# EAGLE board bm812i (EAGLE 6.6.0), part 1 of 4
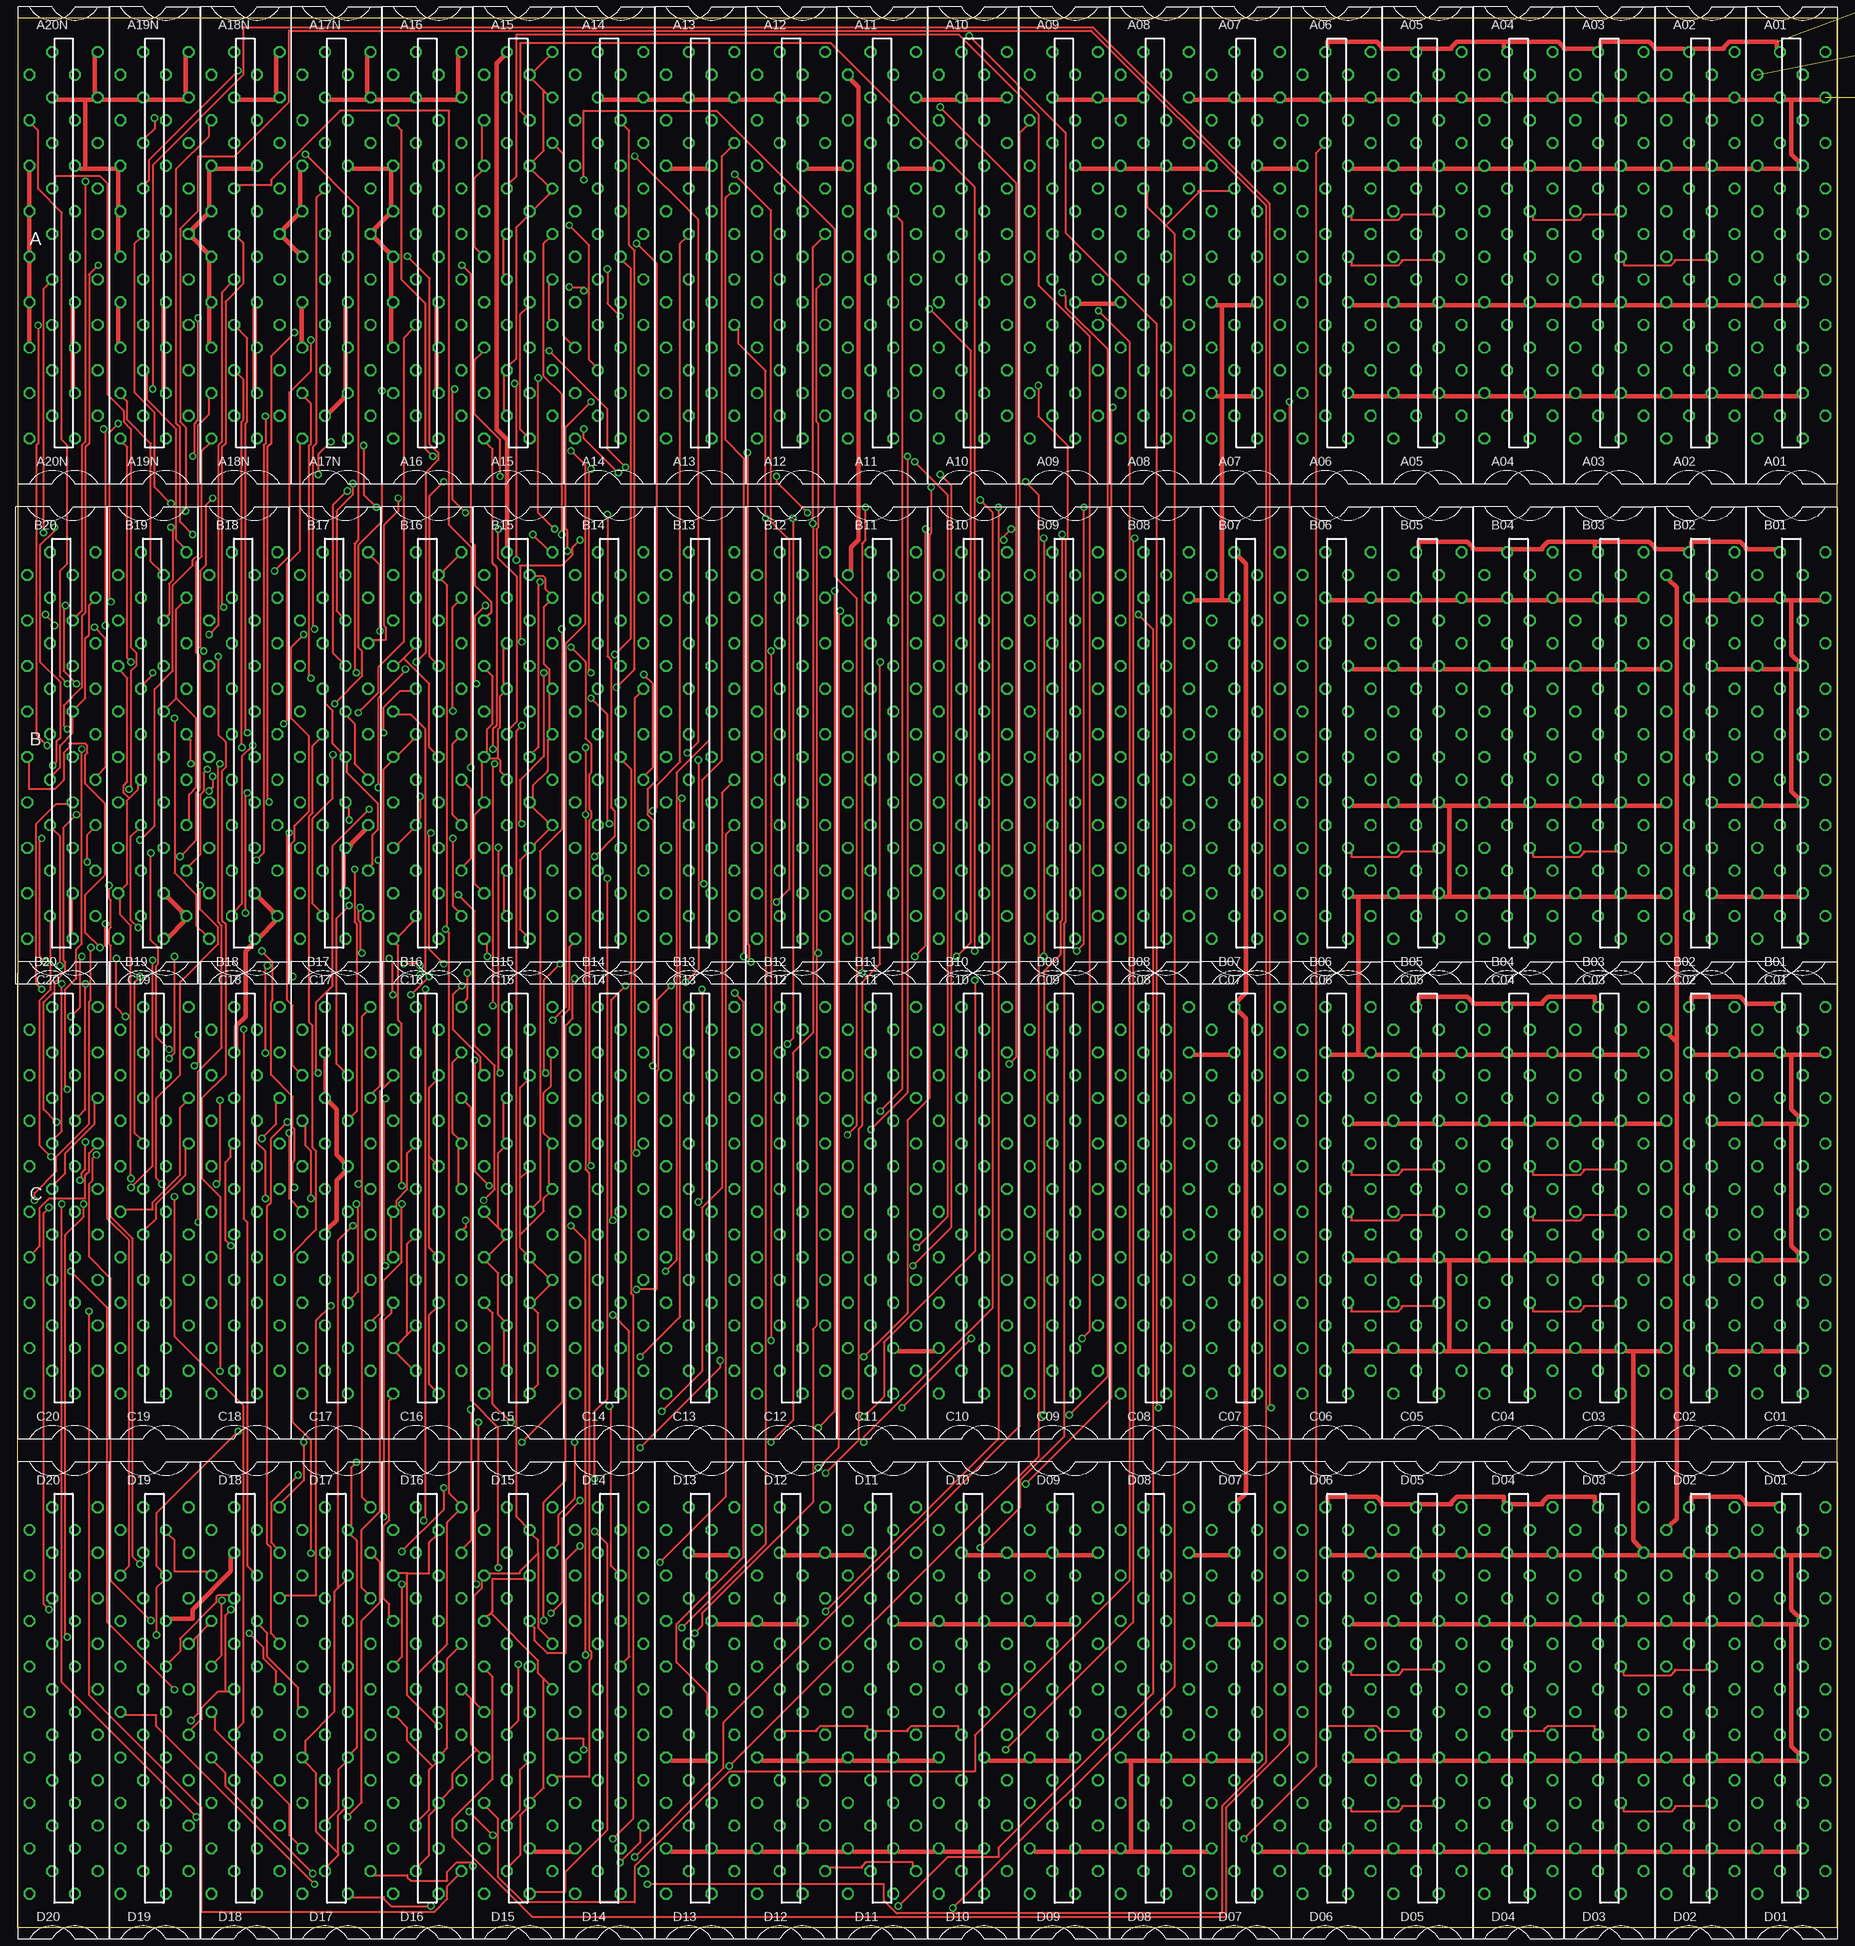
[diagram p5: board, top side]
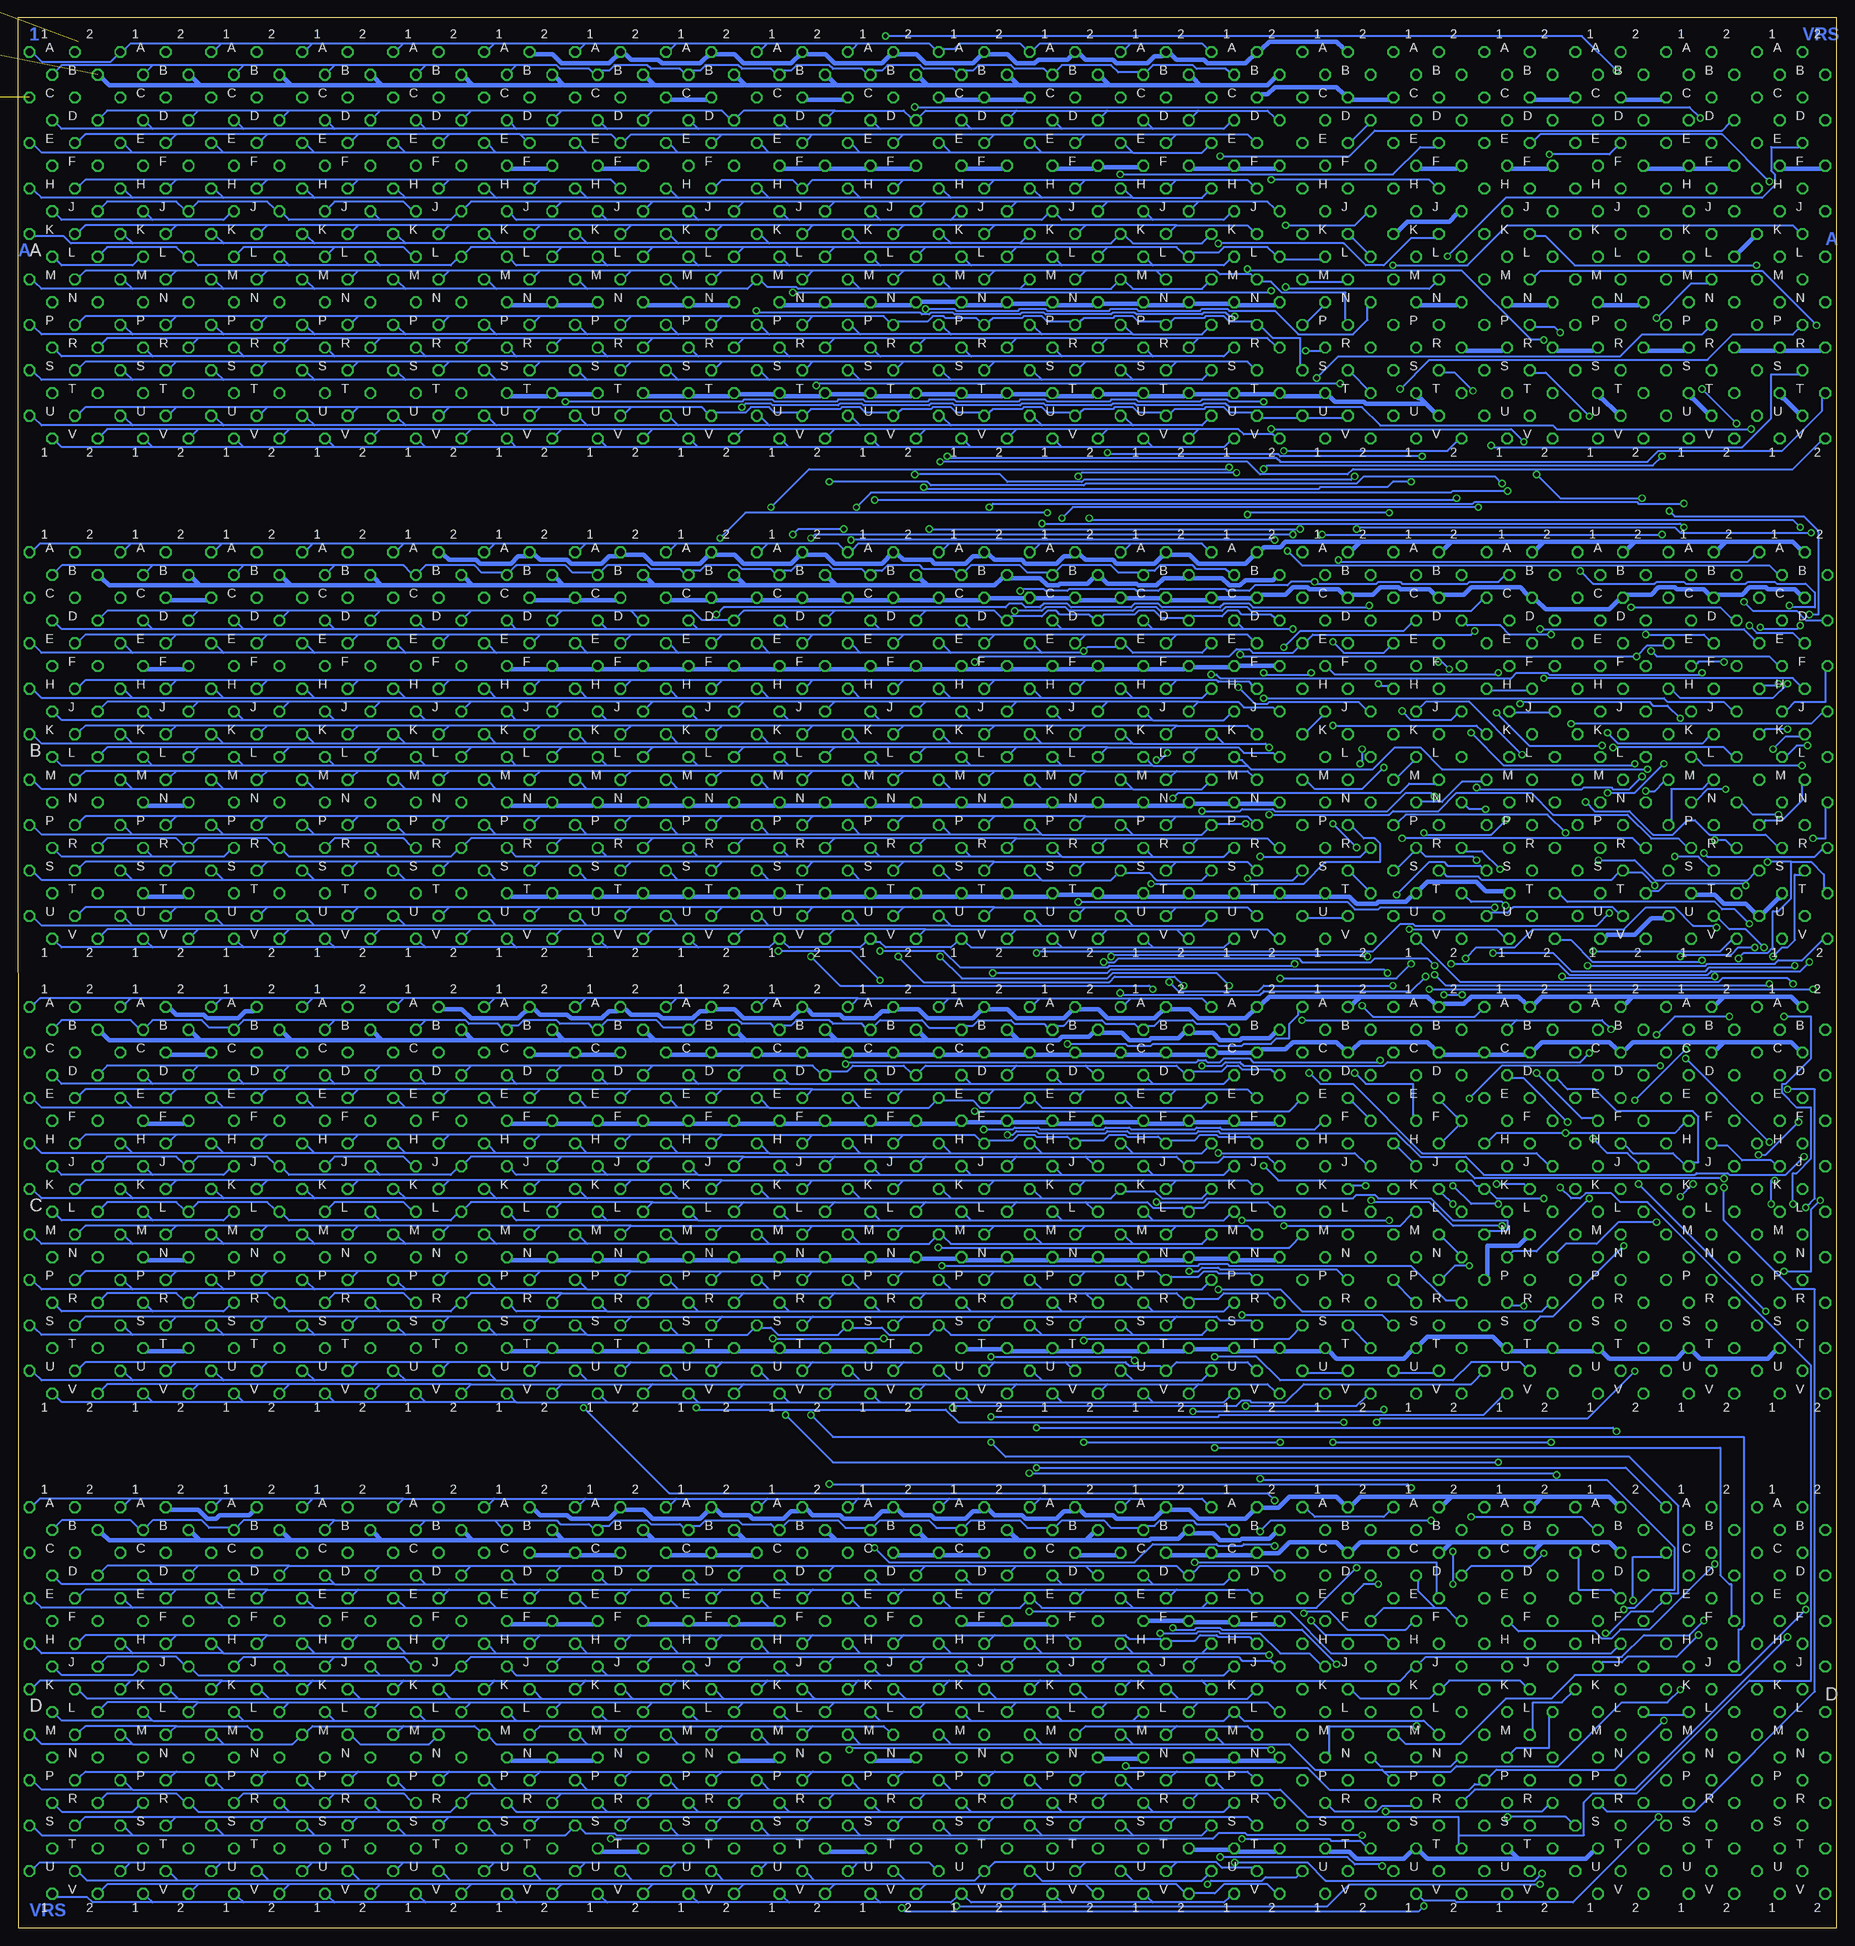
[diagram p6: board, bottom side, seen from below]

Size 254.06 x 266.69 mm. Coordinates in mm from the lower left corner, seen from the top.
Outline: 254.03,0 0,0 0.03,266.67 254.06,266.69 254.03,0
Copper layers (1*2*15*16): Top 0.035mm / dielectric 1.5mm / Route2 0.035mm / dielectric 0.15mm / Route15 0.035mm / dielectric 0.2mm / Bottom 0.035mm
Design rules "10mils *": minimum track width 10mil, minimum drill 24mil, track to track 5mil, track to pad 10mil, pad to pad 10mil, via to via 5mil, smd to smd 10mil, copper to edge 10mil, drill to drill 10mil, minimum pad ring 10mil, minimum via ring 8mil, stop-mask expansion 0mil, vias tented up to drill 0mil, thermal gap 10mil
Net classes: 1 Power: width 0.635 mm

## Footprints (pad centres in the part's own frame; a part is rotated, then mirrored left to right if it is on the bottom)
2,54/0,8 = drill 0.813 pad 2.54 octagon: 1 0,0
H807 = drill 1.092 octagon: A1 4.763,28.575; A2 -1.587,28.575; B1 1.587,25.4; B2 -4.763,25.4; C1 4.763,22.225; C2 -1.587,22.225; D1 1.587,19.05; D2 -4.763,19.05; E1 4.763,15.875; E2 -1.587,15.875; F1 1.587,12.7; F2 -4.763,12.7; H1 4.763,9.525; H2 -1.587,9.525; J1 1.587,6.35; J2 -4.763,6.35; K1 4.763,3.175; K2 -1.587,3.175; L1 1.587,0; L2 -4.763,0; M1 4.763,-3.175; M2 -1.587,-3.175; N1 1.587,-6.35; N2 -4.763,-6.35; P1 4.763,-9.525; P2 -1.587,-9.525; R1 1.587,-12.7; R2 -4.763,-12.7; S1 4.763,-15.875; S2 -1.587,-15.875; T1 1.587,-19.05; T2 -4.763,-19.05; U1 4.763,-22.225; U2 -1.587,-22.225; V1 1.587,-25.4; V2 -4.763,-25.4

## Placement (x,y rotation side)
+5V  [2,54/0,8]  258.8,268.27 0 top  (outside the outline)
-15V  [2,54/0,8]  258.8,261.92 0 top  (outside the outline)
A01  M916  [H807]  247.69,233.35 0 top
A02  M916  [H807]  234.99,233.35 0 top
A03  M916  [H807]  222.29,233.35 0 top
A04  M916  [H807]  209.59,233.35 0 top
A05  M916  [H807]  196.89,233.35 0 top
A06  M916  [H807]  184.19,233.35 0 top
A07  M916  [H807]  171.49,233.35 0 top
A08  M916  [H807]  158.79,233.35 0 top
A09  M916  [H807]  146.09,233.35 0 top
A10  M916  [H807]  133.39,233.35 0 top
A11  M916  [H807]  120.69,233.35 0 top
A12  M916  [H807]  107.99,233.35 0 top
A13  M916  [H807]  95.29,233.35 0 top
A14  M916  [H807]  82.59,233.35 0 top
A15  M627  [H807]  69.89,233.35 0 top
A16  M903  [H807]  57.19,233.35 0 top
A17N  M903  [H807]  44.49,233.35 0 top
A18N  M903  [H807]  31.79,233.35 0 top
A19N  M903  [H807]  19.09,233.35 0 top
A20N  M903  [H807]  6.39,233.35 0 top
B01  M916  [H807]  247.69,163.5 0 top
B02  M916  [H807]  234.99,163.5 0 top
B03  M916  [H807]  222.29,163.5 0 top
B04  M916  [H807]  209.59,163.5 0 top
B05  M916  [H807]  196.89,163.5 0 top
B06  M916  [H807]  184.19,163.5 0 top
B07  M916  [H807]  171.49,163.5 0 top
B08  M916  [H807]  158.79,163.5 0 top
B09  M916  [H807]  146.09,163.5 0 top
B10  M916  [H807]  133.39,163.5 0 top
B11  M916  [H807]  120.69,163.5 0 top
B12  M916  [H807]  107.99,163.5 0 top
B13  M916  [H807]  95.29,163.5 0 top
B14  M916  [H807]  82.59,163.5 0 top
B15  M627  [H807]  69.89,163.5 0 top
B16  M115  [H807]  57.19,163.5 0 top
B17  M113  [H807]  44.17,163.5 0 top
B18  M623  [H807]  31.47,163.5 0 top
B19  M623  [H807]  18.77,163.5 0 top
B20  M623  [H807]  6.07,163.5 0 top
C01  M916  [H807]  247.69,100 0 top
C02  M916  [H807]  234.99,100 0 top
C03  M916  [H807]  222.29,100 0 top
C04  M916  [H807]  209.59,100 0 top
C05  M916  [H807]  196.89,100 0 top
C06  M916  [H807]  184.19,100 0 top
C07  M916  [H807]  171.49,100 0 top
C08  M916  [H807]  158.79,100 0 top
C09  M916  [H807]  146.09,100 0 top
C10  M916  [H807]  133.39,100 0 top
C11  M916  [H807]  120.69,100 0 top
C12  M916  [H807]  107.99,100 0 top
C13  M916  [H807]  95.29,100 0 top
C14  M916  [H807]  82.59,100 0 top
C15  M627  [H807]  69.89,100 0 top
C16  M627  [H807]  57.19,100 0 top
C17  M206X  [H807]  44.49,100 0 top
C18  M310  [H807]  31.79,100 0 top
C19  M310  [H807]  19.09,100 0 top
C20  M310  [H807]  6.39,100 0 top
D01  M916  [H807]  247.69,30.15 0 top
D02  M916  [H807]  234.99,30.15 0 top
D03  M916  [H807]  222.29,30.15 0 top
D04  M916  [H807]  209.59,30.15 0 top
D05  M916  [H807]  196.89,30.15 0 top
D06  M916  [H807]  184.19,30.15 0 top
D07  M916  [H807]  171.49,30.15 0 top
D08  M916  [H807]  158.79,30.15 0 top
D09  M916  [H807]  146.09,30.15 0 top
D10  M916  [H807]  133.39,30.15 0 top
D11  M916  [H807]  120.69,30.15 0 top
D12  M916  [H807]  107.99,30.15 0 top
D13  M916  [H807]  95.29,30.15 0 top
D14  M916  [H807]  82.59,30.15 0 top
D15  M206X  [H807]  69.89,30.15 0 top
D16  M206X  [H807]  57.19,30.15 0 top
D17  M206X  [H807]  44.49,30.15 0 top
D18  M111  [H807]  31.79,30.15 0 top
D19  M921  [H807]  19.09,30.15 0 top
D20  H807  [H807]  6.39,30.15 0 top
GND  [2,54/0,8]  258.48,255.57 0 top  (outside the outline)

## Tracks (layer width: path | path; a pad name or v marks a point on that pad's centre or on a via)
-15V  (1 unrouted)
  Top 0.635: 231.68,123.69 231.68,57.14 230.67,56.12 D02.B2 | 231.68,123.69 230.67,124.7 C02.B2 | 231.68,123.69 231.68,187.19 230.67,188.2 B02.B2 | A11.B2 116.37,258.05 117.38,257.04 117.38,193.79 116.37,192.77 116.37,189.47 B11.B2
  Bottom 0.635: 88.94,257.29 79.54,257.29 78.52,258.31 A14.B2 | 88.94,257.29 89.95,258.31 A13.B2 | 101.76,257.42 101.64,257.29 88.94,257.29 | 101.76,257.42 102.65,258.31 A12.B2 | 114.46,257.42 114.34,257.29 101.89,257.29 101.76,257.42 | 114.46,257.42 115.35,258.31 A11.B2 | 127.16,257.42 127.04,257.29 114.59,257.29 114.46,257.42 | 127.16,257.42 128.05,258.31 A10.B2 | 139.86,257.42 139.74,257.29 127.29,257.29 127.16,257.42 | 139.86,257.42 140.75,258.31 A09.B2 | 152.56,257.42 152.44,257.29 139.99,257.29 139.86,257.42 | 152.56,257.42 153.45,258.31 A08.B2 | 165.26,257.42 165.14,257.29 152.69,257.29 152.56,257.42 | 165.26,257.42 166.15,258.31 A07.B2 | 177.96,257.42 177.84,257.29 165.39,257.29 165.26,257.42 | 177.96,257.42 178.85,258.31 A06.B2 | 190.66,257.42 190.54,257.29 178.09,257.29 177.96,257.42 | 190.66,257.42 191.55,258.31 A05.B2 | 203.36,257.42 203.24,257.29 190.79,257.29 190.66,257.42 | 203.36,257.42 204.25,258.31 A04.B2 | 216.06,257.42 215.94,257.29 203.49,257.29 203.36,257.42 | 216.06,257.42 216.95,258.31 A03.B2 | 228.76,257.42 228.64,257.29 216.19,257.29 216.06,257.42 | 228.76,257.42 229.65,258.31 A02.B2 | A01.B2 242.35,258.31 241.34,257.29 228.89,257.29 228.76,257.42 | B14.B2 78.52,188.46 78.78,188.2 82.59,188.2 83.35,187.44 84.87,187.44 85.89,188.46 89.95,188.46 B13.B2 91.22,188.46 94.02,188.46 95.03,187.44 97.57,187.44 97.83,187.69 101.89,187.69 102.65,188.46 B12.B2 103.92,188.46 104.68,187.69 108.49,187.69 108.75,187.44 110.27,187.44 111.29,188.46 115.35,188.46 B11.B2 116.62,188.46 117.64,187.44 127.04,187.44 | 127.04,187.44 128.05,188.46 B10.B2 | 139.86,187.57 139.74,187.44 127.04,187.44
  Bottom 0.635: 139.86,187.57 140.75,188.46 B09.B2 | 152.56,187.57 152.44,187.44 139.99,187.44 139.86,187.57 | 152.56,187.57 153.45,188.46 B08.B2 | 165.26,187.57 165.14,187.44 152.69,187.44 152.56,187.57 | 165.26,187.57 166.15,188.46 B07.B2 | 177.96,187.57 177.84,187.44 165.39,187.44 165.26,187.57 | 177.96,187.57 178.85,188.46 B06.B2 | 190.66,187.57 190.54,187.44 178.09,187.44 177.96,187.57 | 190.66,187.57 191.55,188.46 B05.B2 | 203.36,187.57 203.24,187.44 190.79,187.44 190.66,187.57 | 203.36,187.57 204.25,188.46 B04.B2 | 216.06,187.57 215.94,187.44 203.49,187.44 203.36,187.57 | 216.06,187.57 216.95,188.46 B03.B2 | 228.76,187.57 228.64,187.44 216.19,187.44 216.06,187.57 | 228.76,187.57 229.65,188.46 B02.B2 | B01.B2 242.35,188.46 241.34,187.44 228.89,187.44 228.76,187.57 | D14.B2 78.52,55.11 79.28,54.34 83.09,54.34 83.35,54.09 86.14,54.09 87.16,55.11 89.95,55.11 D13.B2 91.22,55.11 91.98,54.34 95.79,54.34 96.05,54.09 104.68,54.09 104.81,54.22 | 104.81,54.22 104.94,54.09 114.34,54.09 | 104.81,54.22 103.92,55.11 D12.B2 | 114.34,54.09 115.35,55.11 D11.B2 | 127.16,54.22 127.04,54.09 114.34,54.09 | 127.16,54.22 128.05,55.11 D10.B2 | 139.86,54.22 139.74,54.09 127.29,54.09 127.16,54.22 | 139.86,54.22 140.75,55.11 D09.B2 | 152.56,54.22 152.44,54.09 139.99,54.09 139.86,54.22 | 152.56,54.22 153.45,55.11 D08.B2 | 165.26,54.22 165.14,54.09 152.69,54.09 152.56,54.22 | 165.26,54.22 166.15,55.11 D07.B2 | 177.96,54.22 177.84,54.09 165.39,54.09 165.26,54.22 | 177.96,54.22 178.85,55.11 D06.B2 | 190.66,54.22 190.54,54.09 178.09,54.09 177.96,54.22 | 190.66,54.22 191.55,55.11 D05.B2 | 203.36,54.22 203.24,54.09 190.79,54.09 190.66,54.22
  Bottom 0.635: 203.36,54.22 204.25,55.11 D04.B2 | 216.06,54.22 215.94,54.09 203.49,54.09 203.36,54.22 | 216.06,54.22 216.95,55.11 D03.B2 | 228.76,54.22 228.64,54.09 216.19,54.09 216.06,54.22 | 228.76,54.22 229.65,55.11 D02.B2 | D01.B2 242.35,55.11 241.34,54.09 228.89,54.09 228.76,54.22 | C14.B2 78.52,124.96 79.28,124.19 83.09,124.19 83.35,123.94 86.14,123.94 87.16,124.96 89.95,124.96 C13.B2 91.22,124.96 91.98,124.19 95.79,124.19 96.05,123.94 98.84,123.94 99.86,124.96 102.65,124.96 C12.B2 103.92,124.96 104.43,124.45 108.24,124.45 108.75,123.94 114.34,123.94 | 114.34,123.94 115.35,124.96 C11.B2 | 127.16,124.07 127.04,123.94 114.34,123.94 | 127.16,124.07 128.05,124.96 C10.B2 | 139.86,124.07 139.74,123.94 127.29,123.94 127.16,124.07 | 139.86,124.07 140.75,124.96 C09.B2 | 152.56,124.07 152.44,123.94 139.99,123.94 139.86,124.07 | 152.56,124.07 153.45,124.96 C08.B2 | 165.26,124.07 165.14,123.94 152.69,123.94 152.56,124.07 | 165.26,124.07 166.15,124.96 C07.B2 | 177.96,124.07 177.84,123.94 165.39,123.94 165.26,124.07 | 177.96,124.07 178.85,124.96 C06.B2 | 190.66,124.07 190.54,123.94 178.09,123.94 177.96,124.07 | 190.66,124.07 191.55,124.96 C05.B2 | 203.36,124.07 203.24,123.94 190.79,123.94 190.66,124.07 | 203.36,124.07 204.25,124.96 C04.B2 | 216.06,124.07 215.94,123.94 203.49,123.94 203.36,124.07 | 216.06,124.07 216.95,124.96 C03.B2 | 228.76,124.07 228.64,123.94 216.19,123.94 216.06,124.07 | 228.76,124.07 229.65,124.96 C02.B2 | C01.B2 242.35,124.96 241.34,123.94 228.89,123.94 228.76,124.07
A15U1
  Top 0.254: 73.44,256.53 71.92,258.05 A15.B1 72.17,259.07 72.17,259.32 74.2,261.35 A15.A1 | 73.44,256.53 73.95,256.02 A15.C1 | 73.44,256.53 73.44,248.15 71.92,246.62 A15.F1 71.92,245.35 73.95,243.32 A15.H1 74.2,242.3 74.2,242.05 72.17,240.02 A15.J1 71.16,239 69.63,237.48 69.63,219.19 68.62,218.17 A15.S2 67.85,216.9 67.85,211.82 A15.U2
  Bottom 0.254: 168.44,212.33 158.53,212.33 157.77,211.57 A08.U2 156.5,211.57 152.44,211.57 151.67,212.33 149.13,212.33 148.37,211.57 145.07,211.57 A09.U2 143.8,211.57 143.29,212.08 139.23,212.08 138.97,212.33 136.43,212.33 135.67,211.57 132.37,211.57 A10.U2 131.1,211.57 130.59,212.08 126.53,212.08 126.27,212.33 123.73,212.33 122.97,211.57 119.67,211.57 A11.U2 118.4,211.57 117.89,212.08 113.83,212.08 113.57,212.33 111.03,212.33 110.27,211.57 106.97,211.57 A12.U2 105.7,211.57 105.19,212.08 101.13,212.08 100.87,212.33 98.33,212.33 97.57,211.57 94.27,211.57 A13.U2 93,211.57 92.49,212.08 88.43,212.08 88.17,212.33 85.63,212.33 84.87,211.57 81.57,211.57 A14.U2 80.3,210.81 75.22,210.81 A15.U1 73.95,210.81 68.87,210.81 A15.U2 | 168.44,212.33 169.2,211.57 A07.U2 | 181.14,212.33 181.9,211.57 A06.U2 | 168.44,212.33 181.14,212.33 | 193.84,212.33 194.6,211.57 A05.U2 | 181.14,212.33 193.84,212.33 | 206.54,212.33 207.3,211.57 A04.U2 | 193.84,212.33 206.54,212.33 | 219.24,212.33 220,211.57 A03.U2 | 206.54,212.33 219.24,212.33 | 231.94,212.33 232.7,211.57 A02.U2 | 219.24,212.33 231.94,212.33 | 231.94,212.33 244.64,212.33 245.4,211.57 A01.U2 | A15.T2 65.57,214.87 67.6,216.9 67.85,216.9 A15.S2
A15V1
  Top 0.254: A15.V1 70.14,209.28 70.14,225.29 71.16,226.3 A15.N1 | A15.D2 64.81,251.7 64.81,246.62 A15.F2 64.81,245.35 63.79,244.34 63.79,234.68 A15.L2 | A15.K2 67.85,235.95 67.85,230.87 A15.M2 | A15.P1 74.2,224.52 74.2,229.6 A15.M1
  Bottom 0.254: A15.P1 73.95,224.27 71.92,226.3 A15.N1 | A15.E2 67.6,249.67 65.57,251.7 A15.D2 | A15.L2 65.57,233.92 67.6,235.95 67.85,235.95 A15.K2 | A15.M2 68.87,229.86 73.95,229.86 A15.M1
B17S1  (via drill 0.61)
  Top 0.254: B17.H2 42.96,172.45 42.96,170.93 43.98,169.91 43.98,165.34 45.25,164.07 B17.L1 46.01,162.8 46.01,161.28 50.33,156.96 50.33,153.4 49.57,152.64 49.57,148.58 49.31,148.32 B17.S1 | 44.74,10.4 44.74,15.74 45.76,16.75 D17.R1 | 44.74,10.4 44.74,10.15 43.22,8.62 D17.U2 | 44.74,10.4 41.69,13.45 41.69,21.58 40.17,23.1 D17.N2 40.17,24.37 40.17,26.15 44.23,30.21 44.23,46.98 44.74,47.49 | 44.74,47.49 45.76,48.5 D17.D1 | v61.5,144.26 63.79,141.97 63.79,123.18 66.58,120.38 66.58,103.11 v65.06,101.59 | v46.77,98.03 44.74,96 44.74,47.49
  Bottom 0.254: B17.H2 43.22,172.71 48.3,172.71 B17.H1 | v61.5,144.26 56.93,148.83 54.9,148.83 54.39,148.32 49.82,148.32 49.57,148.07 B17.S1 | v65.06,101.59 64.81,101.33 56.93,101.33 53.63,98.03 v46.77,98.03
B17V1  (via drill 0.61)
  Top 0.254: D16.K2 55.92,34.02 55.92,35.55 59.98,39.61 59.98,56.63 61.5,58.15 D16.A1 61.5,59.42 60.23,60.69 60.23,138.93 v59.73,139.43 59.98,139.69 59.98,187.44 59.22,188.2 B16.B1 59.47,189.22 59.47,189.47 61.5,191.5 B16.A1
  Bottom 0.254: D16.A1 63.28,57.39 72.93,57.39 73.95,58.41 D15.A1 | D17.K2 43.47,33.77 44.23,34.53 54.14,34.53 54.9,33.77 D16.K2 56.93,31.99 66.58,31.99 67.6,33.01 D15.K2 | v59.73,139.43 47.53,139.43 46.52,138.42 B17.V1
C16U1
  Top 0.254: C16.N2 52.11,94.22 52.11,99.3 C16.L2 52.87,100.57 52.87,101.59 54.39,103.11 54.39,108.19 55.15,108.95 C16.H2 | C16.U2 54.9,78.22 52.87,80.25 C16.T2 53.12,81.27 53.12,81.52 54.39,82.79 | 54.39,82.79 55.15,83.55 C16.S2 | 54.39,82.79 54.39,95.49 55.15,96.25 C16.M2
  Bottom 0.254: C16.H2 54.9,109.97 52.87,112 C16.F2 52.87,113.27 53.12,113.27 55.15,115.3 C16.E2 | C16.N2 52.87,94.22 54.9,96.25 55.15,96.25 C16.M2 | C16.U1 61.25,77.46 56.17,77.46 C16.U2
D01BINIT  (via drill 0.61)
  Top 0.254: v51.09,57.39 51.09,84.82 52.11,85.84 52.11,86.6 C16.R2 | v67.35,202.68 67.35,207.76 63.79,211.32 63.79,218.94 64.81,219.95 A15.R2 | v128.81,202.93 130.34,201.41 130.34,97.78 v125,92.44
  Bottom 0.254: v51.09,57.39 35.6,57.39 34.07,55.87 D18.B1 | v67.35,202.68 67.85,202.17 105.19,202.17 105.45,201.92 115.86,201.92 116.88,202.93 v128.81,202.93 | v125,92.44 89.19,92.44 88.94,92.7 85.13,92.7 84.87,92.44 59.47,92.44 54.65,87.62 53.12,87.62 C16.R2
D01BTP2L  (via drill 0.61)
  Top 0.254: B16.U2 55.15,140.7 55.15,140.45 53.12,138.42 B16.V2 52.87,137.4 53.12,137.15 53.12,126.73 53.63,126.23 v53.63,103.62 | v43.72,86.86 41.69,84.82 41.69,46.47 37.12,46.47 D18.E1 | v47.28,101.08 47.53,100.83 47.53,88.89 46.52,87.87 C17.R1
  Bottom 0.254: v43.72,86.86 45.5,86.86 C17.R1 | v53.63,103.62 51.09,101.08 v47.28,101.08
D01DEL1H  (via drill 0.61)
  Top 0.254: v9.43,131.81 9.43,114.29 8.42,113.27 C20.F1 | v56.17,133.08 56.93,133.85 56.93,167.37 54.9,169.41 53.12,169.41 B16.J2 | v60.74,169.91 60.74,184.39 61.5,185.15 B16.C1
  Bottom 0.254: v9.43,131.81 9.69,131.56 54.65,131.56 v56.17,133.08 | v60.74,169.91 59.47,168.64 53.88,168.64 53.12,169.41 B16.J2
D01DEL1L  (via drill 0.61)
  Top 0.254: v40.93,101.84 40.93,108.45 40.17,109.21 40.17,112 C17.F2 | v77.25,178.8 79.28,176.77 79.28,166.1 80.05,165.34 80.05,161.28 79.79,161.02 79.79,156.2 80.05,155.94 80.05,154.93 79.79,154.67 79.79,106.67 v80.05,106.41
  Bottom 0.254: v40.93,101.84 47.53,101.84 48.55,102.86 C17.K1 49.82,103.62 50.33,103.62 51.09,104.38 78.01,104.38 v80.05,106.41 | v77.25,178.8 74.97,181.09 60.49,181.09 59.47,182.11 B16.D1
D01DEL2  (via drill 0.61)
  Top 0.254: v39.91,180.58 38.14,178.8 38.14,168.9 40.68,166.36 40.68,155.94 38.64,153.91 38.64,151.88 38.14,151.37 38.14,133.08 v38.39,132.83 | v17.05,132.83 16.29,132.07 16.29,110.99 17.05,110.22 C19.H2
  Bottom 0.254: C20.J1 8.67,106.67 9.18,107.18 13.24,107.18 15.28,109.21 16.8,109.21 C19.H2 | v39.91,180.58 45.76,180.58 47.03,181.85 51.6,181.85 51.85,182.11 B16.D2 | v38.39,132.83 38.14,132.58 17.31,132.58 v17.05,132.83
D01DEL3  (via drill 0.61)
  Top 0.254: C17.L2 37.88,101.84 v37.88,110.99
  Bottom 0.254: C19.F1 21.37,112.26 22.64,110.99 v37.88,110.99 47.53,110.99 48.55,109.97 C17.H1
D01DEL4  (via drill 0.61)
  Top 0.254: B16.P1 61.5,154.67 60.74,155.44 60.74,165.34 61.5,166.1 B16.K1 | v29.75,95.24 28.99,96 28.99,106.92 29.75,107.68 29.75,108.95 C18.H2 | v37.88,152.9 37.63,152.64 37.63,129.53 38.39,128.77 38.39,120.38 C17.D2
  Bottom 0.254: C18.H2 29.5,109.21 28.48,108.19 22.9,108.19 21.37,106.67 C19.J1 20.1,106.92 19.34,106.92 19.34,113.27 20.1,114.03 30.77,114.03 33.82,117.08 37.63,117.08 39.15,118.61 C17.D2 | v29.75,95.24 39.66,85.33 41.44,85.33 42.2,84.57 C17.S2 | v37.88,152.9 40.42,155.44 60.23,155.44 61.25,154.42 B16.P1
D01DEL5  (via drill 0.61)
  Top 0.254: v34.58,101.84 34.58,108.45 33.31,109.72 33.31,112 C18.F1 | v49.06,156.2 43.98,151.12 43.98,131.56 41.69,129.27 41.69,119.62 v41.95,119.37
  Bottom 0.254: v34.58,101.84 41.95,94.48 45.25,94.48 C17.N1 | v49.06,156.2 51.34,156.2 51.85,156.71 B16.N2 | v41.95,119.37 35.6,113.02 34.07,113.02 C18.F1
D01DONEH  (via drill 0.61)
  Top 0.254: v41.18,7.61 28.99,19.8 28.99,21.58 27.47,23.1 D18.N2 | v84.11,9.13 86.9,11.93 86.9,13.7 D14.S1
  Bottom 0.254: 187.23,12.94 177.58,12.94 D07.S1 175.55,13.96 174.79,13.2 170.72,13.2 170.47,12.94 161.83,12.94 | 187.23,12.94 188.25,13.96 D06.S1 | 199.93,12.94 200.95,13.96 D05.S1 | 199.93,12.94 187.23,12.94 | 212.63,12.94 213.65,13.96 D04.S1 | 212.63,12.94 199.93,12.94 | 225.33,12.94 226.35,13.96 D03.S1 | 225.33,12.94 212.63,12.94 | 238.03,12.94 239.05,13.96 D02.S1 | 238.03,12.94 225.33,12.94 | 238.03,12.94 250.73,12.94 251.75,13.96 D01.S1 | D14.S1 88.68,12.94 98.33,12.94 | 98.33,12.94 99.35,13.96 D13.S1 | 111.03,12.94 112.05,13.96 D12.S1 | 111.03,12.94 98.33,12.94 | 123.73,12.94 124.75,13.96 D11.S1 | 123.73,12.94 111.03,12.94 | 136.43,12.94 137.45,13.96 D10.S1 | 136.43,12.94 123.73,12.94 | 149.13,12.94 150.15,13.96 D09.S1 | 149.13,12.94 136.43,12.94 | 161.83,12.94 162.85,13.96 D08.S1 | 161.83,12.94 149.13,12.94 | v41.18,7.61 42.2,6.59 71.41,6.59 73.95,9.13 v84.11,9.13
D01DONEL  (via drill 0.61)
  Top 0.254: v21.88,102.1 21.88,82.54 31.53,72.89 31.53,28.69 30.52,27.67 D18.M2 | v20.1,103.87 19.34,104.64 19.34,115.81 22.64,119.11 22.64,132.07 27.98,137.4 27.98,139.69 25.44,142.23 v25.44,145.53
  Bottom 0.254: v21.88,102.1 v20.1,103.87 | v25.44,145.53 27.21,147.31 29.25,147.31 B18.S2 30.52,147.31 31.53,146.29 49.57,146.29 50.07,146.8 54.39,146.8 54.9,147.31 B16.S2
D01INHIBIT
  Bottom 0.254: A15.S1 74.97,218.17 74.97,221.98 78.78,221.98 80.3,223.51 A14.P2 81.57,224.27 84.87,224.27 85.63,225.03 88.17,225.03 88.43,224.78 92.49,224.78 93,224.27 A13.P2 94.27,224.27 97.57,224.27 98.33,225.03 100.87,225.03 101.13,224.78 105.19,224.78 105.7,224.27 A12.P2 106.97,224.27 110.27,224.27 111.03,225.03 113.57,225.03 113.83,224.78 117.89,224.78 118.4,224.27 A11.P2 119.67,224.27 120.18,224.78 124.5,224.78 124.75,225.03 126.27,225.03 127.04,224.27 131.1,224.27 A10.P2 132.37,224.27 133.13,225.03 143.04,225.03 | 143.04,225.03 143.8,224.27 A09.P2 | 155.74,225.03 156.5,224.27 A08.P2 | 143.04,225.03 155.74,225.03 | 168.44,225.03 169.2,224.27 A07.P2 | 155.74,225.03 168.44,225.03 | 181.14,225.03 181.9,224.27 A06.P2 | 168.44,225.03 181.14,225.03 | 193.84,225.03 194.6,224.27 A05.P2 | 181.14,225.03 193.84,225.03 | 206.54,225.03 207.3,224.27 A04.P2 | 193.84,225.03 206.54,225.03 | 219.24,225.03 220,224.27 A03.P2 | 206.54,225.03 219.24,225.03 | 231.94,225.03 232.7,224.27 A02.P2 | 219.24,225.03 231.94,225.03 | 231.94,225.03 244.64,225.03 245.4,224.27 A01.P2
D01INITL  (via drill 0.61)
  Top 0.254: 48.04,104.38 v47.53,103.87 | 48.04,104.38 48.04,127.24 48.8,128 C17.A1 | 48.04,104.38 48.04,60.19 48.8,59.42 D17.A1 | v66.33,164.58 66.33,167.37 66.84,167.88 66.84,189.98 66.33,190.49 66.33,206.49 65.57,207.25 A15.V2 | v66.58,162.55 66.33,162.29 v66.33,128.77
  Bottom 0.254: v47.53,103.87 43.72,103.87 43.47,103.62 C17.K2 | v66.33,164.58 66.33,162.55 v66.58,162.55 | v66.33,128.77 64.81,127.24 50.58,127.24 C17.A1
D01LOADMDL
  Top 0.254: B17.M1 48.55,161.02 47.03,162.55 47.03,168.14 46.01,169.15 B17.J1
  Bottom 0.254: B17.J2 40.17,169.66 44.99,169.66 B17.J1 | B16.N1 58.2,157.21 55.15,157.21 52.36,160.01 49.57,160.01 B17.M1
D01MEMDONEL  (via drill 0.61)
  Top 0.254: v21.88,168.9 21.88,147.31 24.93,144.26 24.93,139.94 26.2,138.67 B18.V2 | v44.23,170.93 48.04,174.74 48.04,178.3 47.53,178.8 47.53,193.03 50.84,196.33 v50.84,214.62
  Bottom 0.254: v21.88,168.9 23.66,170.68 25.69,170.68 26.2,171.18 43.98,171.18 v44.23,170.93 | v50.84,214.62 53.38,217.16 54.9,217.16 A16.S2
D01MEMSTARTL  (via drill 0.61)
  Top 0.254: v37.63,112.51 35.34,110.22 35.34,101.33 34.83,100.83 34.83,53.58 35.34,53.07 35.34,41.14 36.1,40.37 D18.H1 | v46.26,142.74 44.49,140.96 44.49,120.64 C17.D1
  Bottom 0.254: v37.63,112.51 43.72,118.61 45.5,118.61 C17.D1 | v46.26,142.74 46.77,143.24 51.09,143.24 51.85,144.01 B16.T2
D01POWEROK  (via drill 0.61)
  Top 0.254: v39.91,67.81 39.91,62.47 36.87,59.42 D18.A1 | v70.39,67.81 75.98,73.39 75.98,127.24 77,128.26 77,136.89 77.51,137.4 B14.V2
  Bottom 0.254: v70.39,67.81 v39.91,67.81 | 92.24,139.43 91.22,138.42 B13.V2 | 101.89,139.43 92.24,139.43 | 101.89,139.43 B12.V2 | 114.59,139.43 B11.V2 | 114.59,139.43 101.89,139.43 | B10.V2 127.29,139.43 | 127.29,139.43 114.59,139.43 | 139.99,139.43 B09.V2 | 127.29,139.43 139.99,139.43 | 152.69,139.43 B08.V2 | 139.99,139.43 152.69,139.43 | 165.39,139.43 B07.V2 | 152.69,139.43 165.39,139.43 | 178.09,139.43 B06.V2 | 165.39,139.43 178.09,139.43 | 190.79,139.43 B05.V2 | 178.09,139.43 190.79,139.43 | 203.49,139.43 B04.V2 | 190.79,139.43 203.49,139.43 | 216.19,139.43 B03.V2 | 203.49,139.43 216.19,139.43 | 228.89,139.43 B02.V2 | 216.19,139.43 228.89,139.43 | B01.V2 241.59,139.43 228.89,139.43 | 92.24,139.43 79.54,139.43 78.52,138.42 B14.V2
D01READH  (via drill 0.61)
  Top 0.254: 53.88,177.28 55.15,178.55 55.15,178.8 B16.E2 | 53.88,177.28 53.12,176.52 B16.F2 | v50.33,149.09 50.58,148.83 50.58,117.59 49.57,116.57 C17.E1 | B16.M1 63.28,158.99 63.28,149.34 62.27,148.32 B16.S1 | 53.88,177.28 57.44,173.72 57.44,164.83 B16.L1
  Bottom 0.254: B16.L1 59.22,162.8 61.25,160.77 B16.M1 | v50.33,149.09 50.84,149.59 57.44,149.59 58.2,150.36 B16.R1 59.22,150.1 61.25,148.07 B16.S1
D01READL  (via drill 0.61)
  Top 0.254: v47.03,147.82 47.03,140.45 47.28,140.2 47.28,114.03 46.52,113.27 C17.F1 | B16.R2 53.12,151.12 53.12,151.37 55.15,153.4 B16.P2 55.92,154.67 56.17,154.93 v56.17,157.98 | v88.68,155.94 89.19,156.45 89.19,159.5 92.49,162.8 92.49,235.19 93.25,235.95 A13.K2
  Bottom 0.254: v47.03,147.82 49.57,150.36 51.85,150.36 B16.R2 | 92.24,237.73 82.33,237.73 81.57,236.97 A14.K2 | 92.24,237.73 93,236.97 A13.K2 | 104.94,237.73 105.7,236.97 A12.K2 | 92.24,237.73 104.94,237.73 | 117.64,237.73 118.4,236.97 A11.K2 | 104.94,237.73 117.64,237.73 | 130.34,237.73 131.1,236.97 A10.K2 | 117.64,237.73 130.34,237.73 | 143.04,237.73 143.8,236.97 A09.K2 | 130.34,237.73 143.04,237.73 | 155.74,237.73 156.5,236.97 A08.K2 | 143.04,237.73 155.74,237.73 | 168.44,237.73 169.2,236.97 A07.K2 | 155.74,237.73 168.44,237.73 | 181.14,237.73 181.9,236.97 A06.K2 | 168.44,237.73 181.14,237.73 | 193.84,237.73 194.6,236.97 A05.K2 | 181.14,237.73 193.84,237.73 | 206.54,237.73 207.3,236.97 A04.K2 | 193.84,237.73 206.54,237.73 | 219.24,237.73 220,236.97 A03.K2 | 206.54,237.73 219.24,237.73 | 231.94,237.73 232.7,236.97 A02.K2 | 219.24,237.73 231.94,237.73 | 231.94,237.73 244.64,237.73 245.4,236.97 A01.K2 | v56.17,157.98 56.68,158.48 60.23,158.48 62.77,155.94 78.52,155.94 78.78,156.2 83.09,156.2 83.35,155.94 v88.68,155.94
D01RETURN
  Top 0.254: A15.E1 76.24,247.64 76.24,222.24 A14.R2
  Bottom 0.254: 89.19,221.98 79.54,221.98 78.52,220.97 A14.R2 | 89.19,221.98 A13.R2 | 101.89,221.98 A12.R2 | 89.19,221.98 101.89,221.98 | 114.59,221.98 A11.R2 | 101.89,221.98 114.59,221.98 | 127.29,221.98 A10.R2 | 114.59,221.98 127.29,221.98 | 139.99,221.98 A09.R2 | 127.29,221.98 139.99,221.98 | 152.69,221.98 A08.R2 | 139.99,221.98 152.69,221.98 | 165.39,221.98 A07.R2 | 152.69,221.98 165.39,221.98 | 178.09,221.98 A06.R2 | 165.39,221.98 178.09,221.98 | 190.79,221.98 A05.R2 | 178.09,221.98 190.79,221.98 | 203.49,221.98 A04.R2 | 190.79,221.98 203.49,221.98 | 216.19,221.98 A03.R2 | 203.49,221.98 216.19,221.98 | 228.89,221.98 A02.R2 | 216.19,221.98 228.89,221.98 | A01.R2 241.59,221.98 228.89,221.98
D01SELECTH  (via drill 0.61)
  Top 0.254: v53.63,101.08 53.63,92.95 51.09,90.41 51.09,85.59 50.58,85.08 50.58,58.15 48.04,55.61 48.04,47.49 48.8,46.72 D17.E1
  Bottom 0.254: v53.63,101.08 55.15,102.6 C16.K2
D01SELECTL  (via drill 0.61)
  Top 0.254: v17.05,50.79 16.04,51.8 16.04,96.25 12.99,99.3 12.99,137.15 12.74,137.4 12.74,139.43 12.99,139.69 12.99,143.5 12.74,143.75 v12.74,145.53
  Bottom 0.254: v17.05,50.79 26.2,41.64 30.26,41.64 31.53,40.37 32.8,40.37 33.82,41.39 44.49,41.39 45.5,42.41 D17.F1 | v12.74,145.53 12.99,145.78 23.91,145.78 24.93,144.77 25.94,144.77 B18.T2
D01SELH  (via drill 0.61)
  Top 0.254: v46.01,15.48 48.04,17.51 48.04,42.91 50.58,45.45 50.58,51.04 D17.C1
  Bottom 0.254: v46.01,15.48 37.88,15.48 37.12,14.72 D18.S1
D01SELL  (via drill 0.61)
  Top 0.254: v15.78,103.37 18.83,106.41 v18.83,135.12
  Bottom 0.254: v15.78,103.37 15.78,98.79 6.13,89.14 3.08,89.14 3.08,33.01 19.85,16.24 32.04,16.24 32.8,17.01 D18.R1 | v18.83,135.12 19.09,134.86 34.07,134.86 37.12,137.91 38.64,137.91 B17.V2
D01SOURCE
  Bottom 0.254: A15.L1 72.17,232.91 77.25,232.91 A14.L2 78.52,233.67 79.54,234.68 85.63,234.68 86.4,233.92 89.95,233.92 A13.L2 91.22,233.67 92.24,234.68 101.89,234.68 | 101.89,234.68 A12.L2 | 114.59,234.68 A11.L2 | 101.89,234.68 114.59,234.68 | 127.29,234.68 A10.L2 | 114.59,234.68 127.29,234.68 | 139.99,234.68 A09.L2 | 127.29,234.68 139.99,234.68 | 152.69,234.68 A08.L2 | 139.99,234.68 152.69,234.68 | 165.39,234.68 A07.L2 | 152.69,234.68 165.39,234.68 | 178.09,234.68 A06.L2 | 165.39,234.68 178.09,234.68 | 178.09,234.68 190.79,234.68 A05.L2 192.82,232.91 193.58,232.14 203.49,232.14 | 203.49,232.14 204.25,232.91 A04.L2 | 216.19,232.14 216.95,232.91 A03.L2 | 203.49,232.14 216.19,232.14 | 216.19,232.14 228.89,232.14 229.65,232.91 A02.L2 230.92,233.67 231.94,234.68 241.59,234.68 A01.L2
D01STROBE
  Bottom 0.254: A15.P2 68.62,224.52 68.62,228.33 77.51,228.33 79.03,229.86 80.3,229.86 A14.M2 81.57,230.62 81.82,230.87 86.14,230.87 86.65,231.38 95.03,231.38 | 95.03,231.38 94.27,230.62 A13.M2 | 95.03,231.38 104.94,231.38 | 104.94,231.38 105.7,230.62 A12.M2 | 117.64,231.38 118.4,230.62 A11.M2 | 104.94,231.38 117.64,231.38 | 130.34,231.38 131.1,230.62 A10.M2 | 117.64,231.38 130.34,231.38 | 143.04,231.38 143.8,230.62 A09.M2 | 130.34,231.38 143.04,231.38 | 155.74,231.38 156.5,230.62 A08.M2 | 143.04,231.38 155.74,231.38 | 168.44,231.38 169.2,230.62 A07.M2 | 155.74,231.38 168.44,231.38 | 181.14,231.38 181.9,230.62 A06.M2 | 168.44,231.38 181.14,231.38 | 193.84,231.38 194.6,230.62 A05.M2 | 181.14,231.38 193.84,231.38 | 206.54,231.38 207.3,230.62 A04.M2 | 193.84,231.38 206.54,231.38 | 219.24,231.38 220,230.62 A03.M2 | 206.54,231.38 219.24,231.38 | 231.94,231.38 232.7,230.62 A02.M2 | 219.24,231.38 231.94,231.38 | 231.94,231.38 244.64,231.38 245.4,230.62 A01.M2
D01STROBEL  (via drill 0.61)
  Top 0.254: v47.53,169.66 50.33,172.45 50.33,176.01 53.88,179.57 53.88,221.98 55.15,223.25 A16.P2 | v32.8,165.09 31.28,163.56 31.28,142.99 30.26,141.97 B18.U2
  Bottom 0.254: B18.U2 30.52,141.72 31.28,142.48 45.25,142.48 46.01,141.72 48.3,141.72 B17.U1 | v47.53,169.66 42.96,165.09 v32.8,165.09
D01WRITE  (via drill 0.61)
  Top 0.254: v77,237.73 79.79,234.94 79.79,218.94 80.55,218.17 A14.S2
  Bottom 0.254: 92.24,218.68 82.33,218.68 81.57,217.92 A14.S2 | 92.24,218.68 93,217.92 A13.S2 | 104.94,218.68 105.7,217.92 A12.S2 | 92.24,218.68 104.94,218.68 | 117.64,218.68 118.4,217.92 A11.S2 | 104.94,218.68 117.64,218.68 | 130.34,218.68 131.1,217.92 A10.S2 | 117.64,218.68 130.34,218.68 | 143.04,218.68 143.8,217.92 A09.S2 | 130.34,218.68 143.04,218.68 | 155.74,218.68 156.5,217.92 A08.S2 | 143.04,218.68 155.74,218.68 | v77,237.73 67.35,237.73 65.82,239.26 A15.J2 | 168.44,218.68 169.2,217.92 A07.S2 | 155.74,218.68 168.44,218.68 | 181.14,218.68 181.9,217.92 A06.S2 | 168.44,218.68 181.14,218.68 | 193.84,218.68 194.6,217.92 A05.S2 | 181.14,218.68 193.84,218.68 | 206.54,218.68 207.3,217.92 A04.S2 | 193.84,218.68 206.54,218.68 | 219.24,218.68 220,217.92 A03.S2 | 206.54,218.68 219.24,218.68 | 231.94,218.68 232.7,217.92 A02.S2 | 219.24,218.68 231.94,218.68 | 231.94,218.68 244.64,218.68 245.4,217.92 A01.S2
D01WRITEH
  Top 0.254: B16.K2 55.15,166.1 55.15,165.85 53.12,163.82 B16.L2 52.11,162.8 51.09,161.79 51.09,117.34 | 51.09,117.34 52.11,118.35 C16.D2 | 51.09,117.34 50.58,116.83 50.58,85.84 49.57,84.82 C17.S1
D02MEM0  (via drill 0.61)
  Top 0.254: v9.43,243.83 9.43,207.51 8.93,207 8.93,183.88 8.16,183.12 B20.D1
  Bottom 0.254: v9.43,243.83 16.04,250.43 41.44,250.43 42.2,249.67 A17N.E2
D02MEM1  (via drill 0.61)
  Top 0.254: v41.44,181.34 41.18,181.6 41.18,206.74 41.69,207.25 41.69,241.54 42.45,242.3 A17N.H2
  Bottom 0.254: v41.44,181.34 12.99,181.34 11.47,179.82 B20.E1
D02MEM2  (via drill 0.61)
  Top 0.254: v6.89,167.37 6.39,167.88 6.39,170.68 8.93,173.22 8.93,183.12 9.43,183.63 9.43,206.74 9.94,207.25 9.94,230.87 v11.21,232.14
  Bottom 0.254: v6.89,167.37 9.94,167.37 10.2,167.12 B20.K1 | v11.21,232.14 36.61,232.14 40.68,236.21 42.2,236.21 A17N.K2
D02MEM3  (via drill 0.61)
  Top 0.254: v4.1,165.09 2.58,166.61 2.58,207 2.83,207.25 v2.83,223.76
  Bottom 0.254: v4.1,165.09 5.62,165.09 6.89,163.82 B20.L1 | v2.83,223.76 10.45,231.38 41.44,231.38 42.2,230.62 A17N.M2
D02MEM4  (via drill 0.61)
  Top 0.254: v35.09,157.21 34.83,157.47 34.83,206.74 35.34,207.25 35.34,219.44 v38.64,222.75
  Bottom 0.254: v35.09,157.21 33.82,155.94 28.99,155.94 25.69,152.64 22.9,152.64 20.86,154.67 19.85,154.67 17.82,152.64 9.94,152.64 8.42,151.12 B20.R1 | v38.64,222.75 39.41,223.51 42.2,223.51 A17N.P2
D02MEM5  (via drill 0.61)
  Top 0.254: v33.31,149.09 34.33,150.1 34.33,207 34.58,207.25 v34.58,211.06
  Bottom 0.254: v33.31,149.09 28.23,149.09 25.44,146.29 12.48,146.29 11.47,147.31 B20.S1 | v34.58,211.06 40.68,217.16 42.2,217.16 A17N.S2
D02MEM6  (via drill 0.61)
  Top 0.254: v40.93,174.49 40.68,174.74 40.68,207 40.93,207.25 40.93,212.84 40.17,213.6 A17N.T2
  Bottom 0.254: v40.93,174.49 6.13,174.49 5.12,173.47 B20.H2
D02MEM7  (via drill 0.61)
  Top 0.254: v37.12,168.14 37.63,168.64 37.63,190.49 39.41,192.27 39.41,207.25 A17N.V2
  Bottom 0.254: v37.12,168.14 3.59,168.14 2.07,169.66 B20.J2
D02MEM8  (via drill 0.61)
  Top 0.254: v3.34,152.13 3.08,151.88 3.08,135.62 v3.85,134.86 | v53.88,134.61 56.17,134.61 v56.17,134.35 | v102.4,134.86 102.14,135.12 102.14,137.15 101.89,137.4 v101.89,205.98 | v57.95,205.47 56.93,206.49 56.93,226.81 53.63,230.11 53.63,250.94 52.87,251.7 A16.D2
  Bottom 0.254: v3.34,152.13 1.56,152.13 1.56,156.45 B20.N2 | v3.85,134.86 5.12,133.59 17.56,133.59 18.07,133.08 37.37,133.08 38.9,134.61 v53.88,134.61 | v56.17,134.35 57.19,135.37 64.55,135.37 65.06,134.86 74.71,134.86 75.22,135.37 100.37,135.37 100.87,134.86 v102.4,134.86 | v101.89,205.98 101.64,205.73 78.01,205.73 77.76,205.47 v57.95,205.47
D02MEM9  (via drill 0.61)
  Top 0.254: v5.88,134.35 5.88,152.39 4.86,153.4 B20.P2 | v48.04,136.13 47.79,136.39 47.79,140.45 47.53,140.7 47.53,142.23 v47.79,142.48 | v105.95,143.24 107.73,145.02 107.73,193.79 105.19,196.33 105.19,239.76 v100.11,244.84
  Bottom 0.254: v5.88,134.35 6.13,134.1 17.82,134.1 18.32,133.59 37.12,133.59 39.66,136.13 v48.04,136.13 | v47.79,142.48 63.79,142.48 64.04,142.23 67.35,142.23 68.36,143.24 v105.95,143.24 | v100.11,244.84 62.01,244.84 58.2,248.65 56.17,248.65 A16.E2
D02MEM10  (via drill 0.61)
  Top 0.254: v4.61,107.68 3.08,109.21 3.08,129.53 4.61,131.05 4.61,140.7 B20.U2 | v115.86,110.73 117.13,112 117.13,185.66 114.08,188.71 114.08,237.22 97.57,253.73 79.03,253.73 v79.03,244.08
  Bottom 0.254: v4.61,107.68 7.15,105.14 15.02,105.14 15.28,105.4 19.59,105.4 19.85,105.14 49.31,105.14 51.85,107.68 58.2,107.68 61.5,110.99 86.14,110.99 86.4,111.24 89.19,111.24 89.44,110.99 98.84,110.99 99.1,111.24 101.89,111.24 102.14,110.99 111.54,110.99 111.8,111.24 114.59,111.24 115.1,110.73 v115.86,110.73 | v79.03,244.08 56.93,244.08 56.17,243.32 A16.H2
D02MEM11  (via drill 0.61)
  Top 0.254: v34.83,134.35 34.58,134.1 v34.58,122.16 | v88.68,120.38 88.68,154.67 87.92,155.44 87.92,158.99 89.19,160.26 89.19,232.4 v86.4,235.19
  Bottom 0.254: v34.83,134.35 18.32,134.35 18.07,134.61 8.67,134.61 8.16,135.12 4.86,135.12 2.07,137.91 B20.V2 | v34.58,122.16 35.85,120.89 62.77,120.89 63.28,120.38 82.84,120.38 83.35,120.89 85.38,120.89 85.89,120.38 v88.68,120.38 | v86.4,235.19 68.87,235.19 65.82,232.14 63.28,232.14 59.47,235.95 56.17,235.95 A16.K2
D03BEMA0L  (via drill 0.61)
  Top 0.254: v63.54,8.62 63.54,9.13 61.25,9.13 59.98,7.86 59.98,6.59 54.9,6.59 54.39,7.1 54.39,7.35 49.82,7.35 D17.U1 | v86.14,9.89 98.59,22.34 98.59,28.69 139.99,70.09 139.99,250.69 141.01,251.7 A09.D2
  Bottom 0.254: 165.39,253.73 155.74,253.73 154.72,252.72 A08.D2 152.69,253.73 139.99,253.73 | 165.39,253.73 A07.D2 | 178.09,253.73 A06.D2 | 165.39,253.73 178.09,253.73 | 190.79,253.73 A05.D2 | 178.09,253.73 190.79,253.73 | 203.49,253.73 A04.D2 | 190.79,253.73 203.49,253.73 | 216.19,253.73 A03.D2 | 203.49,253.73 216.19,253.73 | 228.89,253.73 A02.D2 | 216.19,253.73 228.89,253.73 | A01.D2 241.59,253.73 228.89,253.73 | 89.19,253.73 79.54,253.73 78.52,252.72 A14.D2 | 89.19,253.73 A13.D2 | 101.89,253.73 A12.D2 | 101.89,253.73 89.19,253.73 | 114.59,253.73 A11.D2 | 114.59,253.73 101.89,253.73 | 114.59,253.73 127.29,253.73 A10.D2 129.32,252.72 130.34,253.73 139.99,253.73 | v63.54,8.62 63.79,8.88 67.35,8.88 68.36,9.89 v86.14,9.89 | A09.D2 139.99,253.73
D03BEMA1L  (via drill 0.61)
  Top 0.254: v63.03,16.24 v66.33,12.94 | v171.23,12.43 181.39,22.59 181.39,247.89 182.15,248.65 A06.E2
  Bottom 0.254: 92.24,250.43 82.33,250.43 81.57,249.67 A14.E2 | 92.24,250.43 93,249.67 A13.E2 | 104.94,250.43 105.7,249.67 A12.E2 | 104.94,250.43 92.24,250.43 | 117.64,250.43 118.4,249.67 A11.E2 | 117.64,250.43 104.94,250.43 | 130.34,250.43 131.1,249.67 A10.E2 | 130.34,250.43 117.64,250.43 | 143.04,250.43 143.8,249.67 A09.E2 | 143.04,250.43 130.34,250.43 | 155.74,250.43 156.5,249.67 A08.E2 | 155.74,250.43 143.04,250.43 | 155.74,250.43 168.44,250.43 169.2,249.67 A07.E2 170.47,249.67 171.23,250.43 183.93,250.43 | v63.03,16.24 41.18,16.24 40.42,17.01 D17.R2 | v66.33,12.94 82.33,12.94 82.59,13.2 86.4,13.2 87.16,12.43 v171.23,12.43 | 193.84,250.43 194.6,249.67 A05.E2 | 183.93,250.43 193.84,250.43 | 183.93,250.43 183.17,249.67 A06.E2 | 206.54,250.43 207.3,249.67 A04.E2 | 193.84,250.43 206.54,250.43 | 219.24,250.43 220,249.67 A03.E2 | 206.54,250.43 219.24,250.43 | 231.94,250.43 232.7,249.67 A02.E2 | 219.24,250.43 231.94,250.43 | 231.94,250.43 244.64,250.43 245.4,249.67 A01.E2
D03BEMA2L  (via drill 0.61)
  Top 0.254: v57.69,3.04 52.11,3.04 51.09,4.05 51.09,4.31 46.77,4.31 D17.V1 | v130.59,2.78 161.58,33.77 161.58,236.46 160.31,237.73 | 160.31,237.73 157.77,240.27 157.77,242.3 A08.H2 | 160.31,237.73 164.88,242.3 164.88,242.56 169.2,242.56 A07.H2
  Bottom 0.254: 92.24,244.08 82.33,244.08 81.57,243.32 A14.H2 | 92.24,244.08 93,243.32 A13.H2 | 104.94,244.08 105.7,243.32 A12.H2 | 104.94,244.08 92.24,244.08 | 117.64,244.08 118.4,243.32 A11.H2 | 117.64,244.08 104.94,244.08 | 130.34,244.08 131.1,243.32 A10.H2 | 130.34,244.08 117.64,244.08 | 130.34,244.08 143.04,244.08 143.8,243.32 A09.H2 145.07,243.32 145.83,244.08 155.74,244.08 156.5,243.32 A08.H2 | v57.69,3.04 58.46,2.27 130.08,2.27 v130.59,2.78 | 181.14,244.08 181.9,243.32 A06.H2 | 181.14,244.08 171.23,244.08 170.47,243.32 A07.H2 | 193.84,244.08 194.6,243.32 A05.H2 | 181.14,244.08 193.84,244.08 | 206.54,244.08 207.3,243.32 A04.H2 | 193.84,244.08 206.54,244.08 | 219.24,244.08 220,243.32 A03.H2 | 206.54,244.08 219.24,244.08 | 231.94,244.08 232.7,243.32 A02.H2 | 219.24,244.08 231.94,244.08 | 231.94,244.08 244.64,244.08 245.4,243.32 A01.H2
D03BMA0  (via drill 0.61)
  Top 0.254: v62.01,232.14 63.28,230.87 63.28,193.54 63.79,193.03 63.79,187.44 66.08,185.15 66.08,183.63 65.57,183.12 B15.D2
  Bottom 0.254: v62.01,232.14 51.6,232.14 46.01,237.73 6.13,237.73 5.37,236.97 A20N.K2
D03BMA1  (via drill 0.61)
  Top 0.254: v67.09,195.31 67.09,191.25 69.63,188.71 69.63,168.39 68.62,167.37 B15.K2 | v3.59,194.81 3.59,228.84 4.35,229.6 A20N.M2
  Bottom 0.254: v67.09,195.31 66.84,195.57 22.64,195.57 21.88,194.81 v3.59,194.81
D03BMA2  (via drill 0.61)
  Top 0.254: v80.55,149.59 83.35,152.39 83.35,155.94 82.84,156.45 82.84,177.03 82.33,177.53 v82.33,197.35 | v62.52,197.6 60.74,199.38 60.74,214.62 v61,214.87
  Bottom 0.254: v80.55,149.59 66.58,149.59 65.82,150.36 B15.R2 | v82.33,197.35 82.08,197.6 v62.52,197.6 | v61,214.87 56.93,218.94 18.07,218.94 14.51,222.49 6.13,222.49 A20N.P2
D03BMA3  (via drill 0.61)
  Top 0.254: v107.48,123.43 108.24,124.19 v108.24,196.84 | v50.07,198.36 48.3,200.14 v48.3,207
  Bottom 0.254: v107.48,123.43 99.35,123.43 99.1,123.18 95.79,123.18 95.54,123.43 86.65,123.43 86.4,123.18 83.09,123.18 82.84,123.43 79.03,123.43 78.27,124.19 76.49,124.19 76.49,126.23 75.22,127.5 75.22,128 C15.A1 | v108.24,196.84 106.72,198.36 v50.07,198.36 | v48.3,207 48.04,206.74 13.24,206.74 9.18,210.81 9.18,216.9 5.37,216.9 A20N.S2
D03BMA4  (via drill 0.61)
  Top 0.254: v119.16,111.49 124.24,116.57 v124.24,205.47
  Bottom 0.254: v119.16,111.49 115.1,111.49 114.84,111.75 111.54,111.75 111.29,111.49 102.4,111.49 102.14,111.75 98.84,111.75 98.59,111.49 89.7,111.49 89.44,111.75 86.14,111.75 85.89,111.49 72.93,111.49 72.17,112.26 C15.F1 | v124.24,205.47 123.99,205.22 78.27,205.22 77.76,204.71 26.45,204.71 24.93,206.24 7.66,206.24 2.07,211.82 2.07,213.6 A20N.T2
D03BMA5  (via drill 0.61)
  Top 0.254: v125.51,94.98 129.83,99.3 129.83,200.14 v125.26,204.71
  Bottom 0.254: C15.M1 76.49,94.98 v125.51,94.98 | v125.26,204.71 82.33,204.71 80.55,202.93 68.36,202.93 67.6,203.7 6.13,203.7 2.32,207.51 A20N.V2
D03BMA6  (via drill 0.61)
  Top 0.254: v86.14,247.38 95.03,238.49 95.03,165.6 v93.51,164.07 | v95.03,163.06 95.03,133.85 v93.25,132.07 | v62.01,131.56 60.74,130.29 60.74,125.46 64.55,121.65 64.55,119.62 C15.D2
  Bottom 0.254: v86.14,247.38 68.11,247.38 64.55,250.94 16.04,250.94 15.02,251.96 A19N.D2 | v93.51,164.07 94.52,163.06 v95.03,163.06 | v93.25,132.07 91.98,130.8 80.81,130.8 80.05,131.56 v62.01,131.56
D03BMA7  (via drill 0.61)
  Top 0.254: v19.09,252.72 19.09,251.19 17.82,249.92 A19N.E2 | v128.81,254.24 139.48,243.57 139.48,121.65 v138.47,120.64 | v63.79,121.15 63.79,105.65 v65.82,103.62
  Bottom 0.254: v19.09,252.72 20.61,254.24 v128.81,254.24 | v138.47,120.64 138.21,120.89 89.44,120.89 89.19,121.15 88.17,121.15 87.92,120.89 86.14,120.89 85.63,121.4 82.08,121.4 81.57,120.89 64.04,120.89 v63.79,121.15 | v65.82,103.62 67.6,103.62 C15.K2
D03BMA8  (via drill 0.61)
  Top 0.254: v30.77,259.32 18.32,246.88 18.32,244.08 17.82,243.57 A19N.H2 | v132.88,264.15 146.34,250.69 146.34,236.72 159.04,224.02 159.04,72.89 v159.29,72.63 | v68.87,70.6 66.33,73.14 66.33,85.84 65.57,86.6 C15.R2
  Bottom 0.254: v30.77,259.32 35.6,264.15 v132.88,264.15 | v159.29,72.63 159.04,72.38 124.5,72.38 122.72,70.6 v68.87,70.6
D03BMA9  (via drill 0.61)
  Top 0.254: v62.77,133.34 62.77,129.78 62.27,129.27 C16.A1 | v117.89,133.34 117.89,193.28 118.4,193.79 v118.4,198.36 | v21.37,198.87 19.09,201.16 19.09,211.57 16.29,214.36 16.29,235.19 17.05,235.95 A19N.K2
  Bottom 0.254: v62.77,133.34 63.28,133.85 101.38,133.85 101.89,133.34 v117.89,133.34 | v118.4,198.36 117.89,198.87 50.84,198.87 50.58,199.12 27.98,199.12 27.72,198.87 v21.37,198.87
D03BMA10  (via drill 0.61)
  Top 0.254: v67.35,119.37 67.09,119.62 v67.09,150.86 | v70.39,154.17 70.14,154.42 70.14,160.26 73.44,163.56 v73.44,175.25 | v80.05,175.25 79.79,175.5 79.79,203.44 v80.05,203.7 | v24.42,205.47 24.67,205.73 24.67,210.05 25.18,210.55 v25.18,224.78
  Bottom 0.254: v67.35,119.37 65.82,117.84 59.22,117.84 59.22,113.27 C16.F1 | v70.39,154.17 v67.09,150.86 | v73.44,175.25 73.7,174.99 79.79,174.99 v80.05,175.25 | v80.05,203.7 79.54,204.2 25.69,204.2 v24.42,205.47 | v25.18,224.78 20.36,229.6 18.07,229.6 A19N.M2
D03BMA11  (via drill 0.61)
  Top 0.254: v62.52,98.79 62.52,97.78 62.27,97.52 C16.M1 | v83.09,98.79 82.84,99.05 82.84,129.53 v84.87,131.56 | v125.26,135.62 126.78,137.15 v126.78,195.31 | v74.97,195.31 72.68,197.6 v72.68,216.4
  Bottom 0.254: v83.09,98.79 v62.52,98.79 | v84.87,131.56 86.65,133.34 101.13,133.34 101.89,132.58 122.21,132.58 v125.26,135.62 | v126.78,195.31 v74.97,195.31 | v72.68,216.4 69.63,219.44 30.26,219.44 27.21,222.49 18.83,222.49 A19N.P2
D03BTP2  (via drill 0.61)
  Top 0.254: D18.D1 32.04,50.53 32.04,98.54 31.53,99.05 v31.53,125.46 | v77.25,206.24 79.28,204.2 79.28,182.11 76.49,179.31 76.49,128.51 v74.71,126.73
  Bottom 0.254: v31.53,125.46 32.8,126.73 44.74,126.73 | 44.74,126.73 C17.B1 | v77.25,206.24 54.39,206.24 53.12,207.51 A16.V2 | v74.71,126.73 44.74,126.73
D03EA0  (via drill 0.61)
  Top 0.254: v71.92,194.55 73.95,192.52 B15.A1 | v24.42,194.55 22.64,196.33 22.64,209.54 22.13,210.05 22.13,245.61 26.71,250.18 26.71,251.7 A18N.D2
  Bottom 0.254: v71.92,194.55 v24.42,194.55
D03EA1  (via drill 0.61)
  Top 0.254: v40.17,247.64 47.53,240.27 47.53,193.79 47.03,193.28 47.03,175.5 v47.28,175.25
  Bottom 0.254: A18N.E2 31.79,247.64 v40.17,247.64 | v47.28,175.25 47.53,174.99 70.14,174.99 70.9,175.76 B15.F1
D03EA2  (via drill 0.61)
  Top 0.254: v63.28,162.04 63.28,192.77 60.23,195.82 60.23,253.73 44.99,253.73 35.34,244.08 35.34,243.32 30.77,243.32 A18N.H2
  Bottom 0.254: v63.28,162.04 66.33,158.99 72.93,158.99 73.95,160.01 B15.M1
D03EMA0H  (via drill 0.61)
  Top 0.254: 25.18,40.88 26.45,42.15 26.45,42.41 D18.F2 | 25.18,40.88 24.42,40.12 D19.H1 | v24.17,28.94 25.18,29.96 25.18,40.88 | v46.77,201.66 46.77,200.14 44.49,197.85 44.49,183.88 45.25,183.12 B17.D1 | v140.75,201.92 142.53,200.14 142.53,65.77 v99.35,22.59
  Bottom 0.254: v24.17,28.94 31.02,22.09 47.53,22.09 48.55,21.07 D17.P1 49.82,20.05 50.58,20.05 51.34,19.29 70.9,19.29 73.95,22.34 99.1,22.34 v99.35,22.59 | v46.77,201.66 47.79,202.68 66.08,202.68 67.09,201.66 104.94,201.66 105.19,201.41 126.53,201.41 127.04,201.92 v140.75,201.92
D03EMA0L  (via drill 0.61)
  Top 0.254: D19.J1 21.12,37.07 22.64,38.6 22.64,40.37 27.72,45.45 27.72,46.22 27.98,46.47 29.5,46.47 D18.E2 | v50.58,181.09 50.58,190.23 49.31,191.5 B17.A1 | v39.15,63.23 35.34,59.42 35.34,53.84 36.1,53.07 D18.C1 | v112.81,63.49 117.38,68.06 117.38,111.49 117.89,112 117.89,132.07 120.43,134.61 v120.43,176.77
  Bottom 0.254: D18.C1 36.1,51.8 36.1,47.23 31.53,47.23 30.77,46.47 D18.E2 | v50.58,181.09 51.09,180.58 73.19,180.58 73.95,179.82 B15.E1 75.98,178.04 81.57,178.04 82.08,178.55 83.86,178.55 84.87,177.53 119.67,177.53 v120.43,176.77 | v39.15,63.23 39.41,63.49 v112.81,63.49
D03EMA1H  (via drill 0.61)
  Top 0.254: v32.29,41.14 34.33,39.1 34.33,37.58 36.1,35.8 36.1,34.02 D18.K1 | v53.12,199.63 53.12,197.85 51.09,195.82 51.09,181.85 51.34,181.6 51.34,179.82 49.57,179.82 B17.E1 | v134.4,199.38 136.18,197.6 136.18,86.6 118.15,68.57 v118.15,67.81
  Bottom 0.254: D18.K1 38.39,31.48 42.45,31.48 42.45,27.67 D17.M2 | v32.29,41.14 31.79,41.14 28.74,44.18 25.69,44.18 D19.E1 23.4,46.72 22.13,46.72 22.13,58.92 28.99,65.77 116.11,65.77 v118.15,67.81 | v53.12,199.63 53.38,199.38 v134.4,199.38
D03EMA1L  (via drill 0.61)
  Top 0.254: v19.34,40.88 19.34,47.49 20.36,48.5 D19.D1 19.34,50.53 19.34,57.9 v30.77,69.33 | v72.93,187.95 72.68,187.69 72.68,164.83 71.92,164.07 B15.L1 | v111.8,69.84 114.08,72.12 v114.08,186.68
  Bottom 0.254: v19.34,40.88 22.39,37.83 29.25,37.83 30.01,37.07 32.8,37.07 D18.J1 | B17.B1 46.52,188.71 47.28,187.95 51.34,187.95 51.6,187.69 60.74,187.69 61,187.95 64.04,187.95 64.3,187.69 72.68,187.69 v72.93,187.95 76.24,187.95 76.74,187.44 81.32,187.44 82.08,186.68 85.13,186.68 85.38,186.93 94.52,186.93 94.78,186.68 97.83,186.68 98.08,186.93 107.22,186.93 107.48,186.68 110.53,186.68 110.78,186.93 113.83,186.93 v114.08,186.68 | v30.77,69.33 31.28,69.84 v111.8,69.84
D03EMA2H
  Top 0.254: D17.T2 37.88,12.94 37.88,17.26 27.47,27.67 27.47,29.45 D18.L2
  Bottom 0.254: D19.L1 21.37,29.71 26.45,29.71 D18.L2
D03EMA2L  (via drill 0.61)
  Top 0.254: 28.99,33.01 29.5,33.01 D18.K2 | 28.99,33.01 27.98,33.01 25.69,30.72 25.69,29.2 24.17,27.67 D19.M1 | v82.33,146.55 82.33,73.9 80.55,72.12 v80.55,62.73 | v29.75,44.44 28.99,43.68 28.99,33.01
  Bottom 0.254: B15.S1 75.98,146.29 82.08,146.29 v82.33,146.55 | v80.55,62.73 80.3,62.47 32.04,62.47 22.64,53.07 22.64,47.23 25.69,47.23 28.23,44.69 29.5,44.69 v29.75,44.44
D03MA0L  (via drill 0.61)
  Top 0.254: v83.6,173.22 86.14,175.76 86.14,234.18 85.38,234.94 85.38,250.94 84.62,251.7 A14.D1
  Bottom 0.254: v83.6,173.22 81.32,170.93 79.54,170.93 79.28,171.18 66.84,171.18 65.82,170.17 B15.J2 | 95.54,251.19 96.3,251.96 A13.D1 | 95.54,251.19 85.63,251.19 84.87,251.96 A14.D1 | 108.24,251.19 109,251.96 A12.D1 | 95.54,251.19 108.24,251.19 | 120.94,251.19 121.7,251.96 A11.D1 | 108.24,251.19 120.94,251.19 | 133.64,251.19 134.4,251.96 A10.D1 | 120.94,251.19 133.64,251.19 | 146.34,251.19 147.1,251.96 A09.D1 | 133.64,251.19 146.34,251.19 | 159.04,251.19 159.8,251.96 A08.D1 | 146.34,251.19 159.04,251.19 | 171.74,251.19 172.5,251.96 A07.D1 | 159.04,251.19 171.74,251.19 | 184.44,251.19 185.2,251.96 A06.D1 | 171.74,251.19 184.44,251.19 | 197.14,251.19 197.9,251.96 A05.D1 | 184.44,251.19 197.14,251.19 | 209.84,251.19 210.6,251.96 A04.D1 | 197.14,251.19 209.84,251.19 | 222.54,251.19 223.3,251.96 A03.D1 | 209.84,251.19 222.54,251.19 | 235.24,251.19 236,251.96 A02.D1 | 222.54,251.19 235.24,251.19 | 235.24,251.19 247.94,251.19 248.7,251.96 A01.D1
D03MA1L  (via drill 0.61)
  Top 0.254: v95.79,145.78 95.54,146.04 95.54,160.26 98.33,163.06 98.33,247.38 99.6,248.65 A13.E1
  Bottom 0.254: v95.79,145.78 74.46,145.78 71.41,148.83 63.79,148.83 63.79,151.37 64.55,152.13 66.08,152.13 67.6,153.66 B15.P2 | A14.E1 88.68,247.89 98.33,247.89 | 98.33,247.89 99.35,248.91 A13.E1 | 111.03,247.89 112.05,248.91 A12.E1 | 98.33,247.89 111.03,247.89 | 123.73,247.89 124.75,248.91 A11.E1 | 111.03,247.89 123.73,247.89 | 136.43,247.89 137.45,248.91 A10.E1 | 123.73,247.89 136.43,247.89 | 149.13,247.89 150.15,248.91 A09.E1 | 136.43,247.89 149.13,247.89 | 161.83,247.89 162.85,248.91 A08.E1 | 149.13,247.89 161.83,247.89 | 174.53,247.89 175.55,248.91 A07.E1 | 161.83,247.89 174.53,247.89 | 187.23,247.89 188.25,248.91 A06.E1 | 174.53,247.89 187.23,247.89 | 199.93,247.89 200.95,248.91 A05.E1 | 187.23,247.89 199.93,247.89 | 212.63,247.89 213.65,248.91 A04.E1 | 199.93,247.89 212.63,247.89 | 225.33,247.89 226.35,248.91 A03.E1 | 212.63,247.89 225.33,247.89 | 238.03,247.89 239.05,248.91 A02.E1 | 225.33,247.89 238.03,247.89 | 238.03,247.89 250.73,247.89 251.75,248.91 A01.E1
D03MA2L  (via drill 0.61)
  Top 0.254: v65.57,135.62 65.57,137.4 B15.V2 | v101.38,135.62 101.38,205.22 98.84,207.76 98.84,241.54 99.6,242.3 A13.H1
  Bottom 0.254: v65.57,135.62 65.82,135.88 101.13,135.88 v101.38,135.62 | A14.H1 88.68,241.54 98.33,241.54 | 98.33,241.54 99.35,242.56 A13.H1 | 111.03,241.54 112.05,242.56 A12.H1 | 98.33,241.54 111.03,241.54 | 123.73,241.54 124.75,242.56 A11.H1 | 111.03,241.54 123.73,241.54 | 136.43,241.54 137.45,242.56 A10.H1 | 123.73,241.54 136.43,241.54 | 149.13,241.54 150.15,242.56 A09.H1 | 136.43,241.54 149.13,241.54 | 161.83,241.54 162.85,242.56 A08.H1 | 149.13,241.54 161.83,241.54 | 174.53,241.54 175.55,242.56 A07.H1 | 161.83,241.54 174.53,241.54 | 187.23,241.54 188.25,242.56 A06.H1 | 174.53,241.54 187.23,241.54 | 199.93,241.54 200.95,242.56 A05.H1 | 187.23,241.54 199.93,241.54 | 212.63,241.54 213.65,242.56 A04.H1 | 199.93,241.54 212.63,241.54 | 225.33,241.54 226.35,242.56 A03.H1 | 212.63,241.54 225.33,241.54 | 238.03,241.54 239.05,242.56 A02.H1 | 225.33,241.54 238.03,241.54 | 238.03,241.54 250.73,241.54 251.75,242.56 A01.H1
D03MA3L  (via drill 0.61)
  Top 0.254: v120.43,114.03 123.48,117.08 123.48,238.24 122.72,239 A11.J1 | A05.J1 197.9,239.26 193.33,239.26 193.33,239 192.82,238.49 186.22,238.49 186.22,239 A06.J1 | A03.J1 223.3,239.26 218.73,239.26 218.73,239 218.22,238.49 211.62,238.49 211.62,239 A04.J1
  Bottom 0.254: 235.24,238.49 225.33,238.49 224.57,239.26 A03.J1 | 235.24,238.49 236,239.26 A02.J1 | 235.24,238.49 247.94,238.49 248.7,239.26 A01.J1 | 95.54,238.49 85.63,238.49 84.87,239.26 A14.J1 | 95.54,238.49 96.3,239.26 A13.J1 | 95.54,238.49 108.24,238.49 109,239.26 A12.J1 110.27,239.26 111.03,238.49 123.73,238.49 | A04.J1 209.84,241.03 200.19,241.03 199.17,240.02 A05.J1 | C15.E1 76.49,114.03 v120.43,114.03 | 133.64,238.49 134.4,239.26 A10.J1 | 123.73,238.49 133.64,238.49 | 123.73,238.49 122.97,239.26 A11.J1 | 146.34,238.49 147.1,239.26 A09.J1 | 133.64,238.49 146.34,238.49 | 159.04,238.49 159.8,239.26 A08.J1 | 146.34,238.49 159.04,238.49 | 171.74,238.49 172.5,239.26 A07.J1 | 159.04,238.49 171.74,238.49 | 171.74,238.49 184.44,238.49 185.2,239.26 A06.J1
D03MA4L  (via drill 0.61)
  Top 0.254: v75.98,181.34 75.98,153.4 72.93,150.36 72.93,101.59 71.92,100.57 C15.L1
  Bottom 0.254: v75.98,181.34 82.84,181.34 | 82.84,181.34 83.6,182.11 B14.D1 | 95.54,181.34 96.3,182.11 B13.D1 | 82.84,181.34 95.54,181.34 | 108.24,181.34 109,182.11 B12.D1 | 95.54,181.34 108.24,181.34 | 120.94,181.34 121.7,182.11 B11.D1 | 108.24,181.34 120.94,181.34 | 133.64,181.34 134.4,182.11 B10.D1 | 120.94,181.34 133.64,181.34 | 146.34,181.34 147.1,182.11 B09.D1 | 133.64,181.34 146.34,181.34 | 159.04,181.34 159.8,182.11 B08.D1 | 146.34,181.34 159.04,181.34 | 171.74,181.34 172.5,182.11 B07.D1 | 159.04,181.34 171.74,181.34 | 184.44,181.34 185.2,182.11 B06.D1 | 171.74,181.34 184.44,181.34 | 197.14,181.34 197.9,182.11 B05.D1 | 184.44,181.34 197.14,181.34 | 209.84,181.34 210.6,182.11 B04.D1 | 197.14,181.34 209.84,181.34 | 222.54,181.34 223.3,182.11 B03.D1 | 209.84,181.34 222.54,181.34 | 235.24,181.34 236,182.11 B02.D1 | 222.54,181.34 235.24,181.34 | 235.24,181.34 247.94,181.34 248.7,182.11 B01.D1
D03MA5L  (via drill 0.61)
  Top 0.254: v105.19,178.3 v105.19,82.03